# EAGLE design plugV17-Add-Large-Cap-to-support-RELAY-smd-big-size-small-pinout (EAGLE 7.6.0)
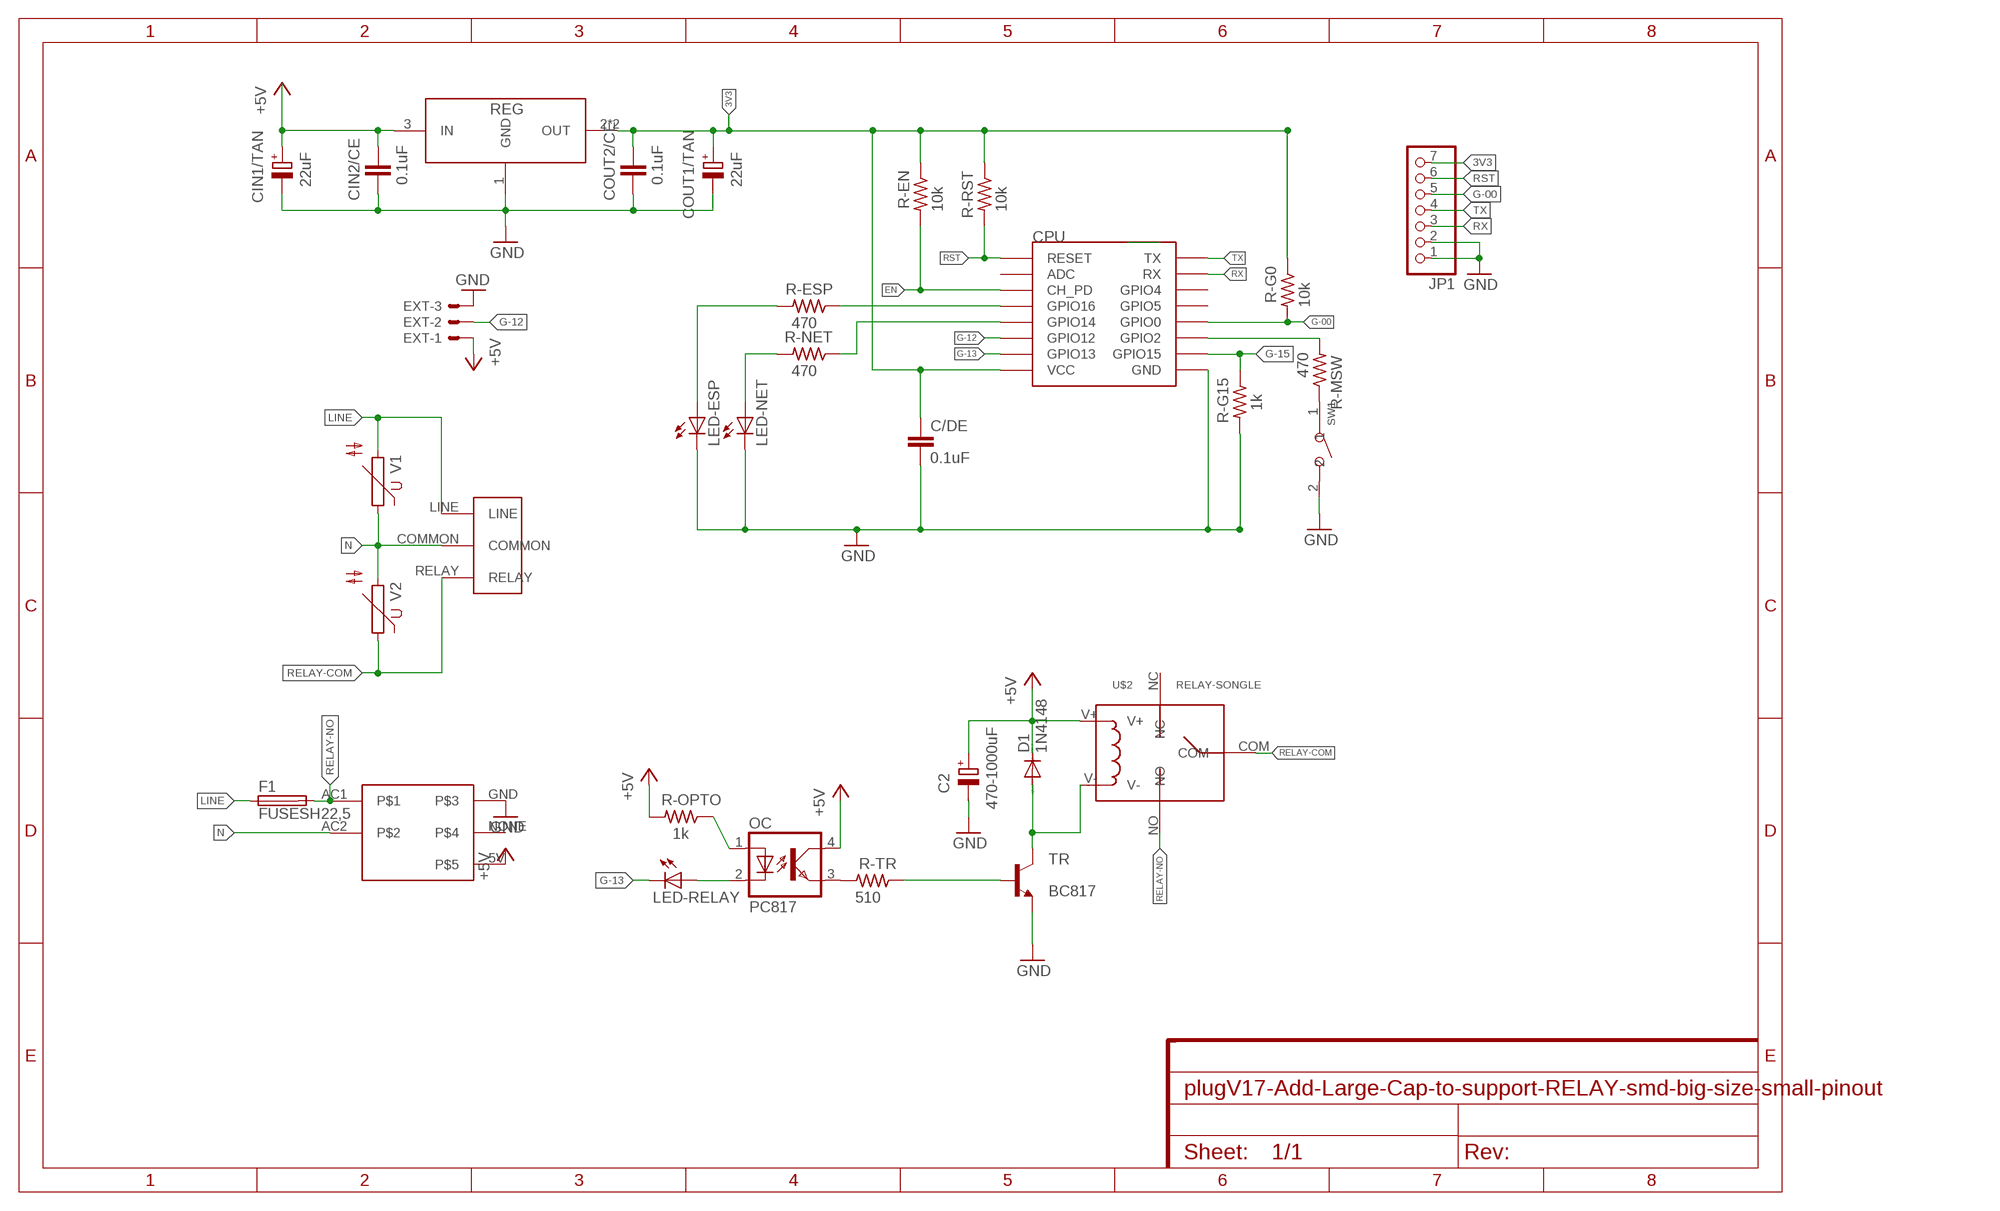
[diagram p0: schematic, sheet 1]

## Parts
C2  470-1000uF  CPOL-EUE3.5-8  [E3,5-8]
C/DE  0.1uF  C-EUC0805  [C0805]
CIN1/TAN  22uF  CPOL-EUB/3528-21R  [B/3528-21R]
CIN2/CE  0.1uF  C-EUC0805K  [C0805K]
COUT1/TAN  22uF  CPOL-EUB/3528-21R  [B/3528-21R]
COUT2/CE  0.1uF  C-EUC0805K  [C0805K]
CPU  ESP12SMD  [ESP12-SMD]
D1  1N4148  1N4148DO35-7  [DO35-7]
EXT  53048-03  [53048-03]
F1  FUSESH22,5  [SH22,5]
JP1  PINHD-1X7  [1X07]
LED-ESP  LEDCHIPLED_0805  [CHIPLED_0805]
LED-NET  LEDCHIPLED_0805  [CHIPLED_0805]
LED-RELAY  LEDCHIPLED_0805  [CHIPLED_0805]
OC  PC817  [DIL04]
R-EN  10k  R-US_M0805  [M0805]
R-ESP  470  R-US_M0805  [M0805]
R-G0  10k  R-US_M0805  [M0805]
R-G15  1k  R-US_M0805  [M0805]
R-MSW  470  R-US_M0805  [M0805]
R-NET  470  R-US_M0805  [M0805]
R-OPTO  1k  R-US_M0805  [M0805]
R-RST  10k  R-US_M0805  [M0805]
R-TR  510  R-US_M0805  [M0805]
REG  AMS1117-3.3  [SOT-223]
SW1  DIP-BUTTON(2P-6.0X3.0X4.3MM)-TS-1101F  [SW2-5.0-6.0X3.0X4.3MM]
TR  BC817  BC817-16SMD  [SOT23-BEC]
U$1  POWER-RELAY-FOOTPRINT  [POWER-RELAY-FOOTPRINT]
U$2  RELAY-SONGLE  [RELAY-SONGLE]
U$4  POWERSUPPLY-5V-700MA  [POWERSUPPLY-5V-700MA]
V1  S14K11  [S14K11]
V2  S14K11  [S14K11]

## Nets
3V3: C/DE.1 COUT1/TAN.+ COUT2/CE.1 CPU.VCC JP1.7 R-EN.1 R-G0.1 R-RST.1 REG.2(OUT) REG.4(OUT)
+5V: C2.+ CIN1/TAN.+ CIN2/CE.1 D1.C EXT.1 OC.4(COL) R-OPTO.2 REG.3(IN) U$2.V+ U$4.5V
EN: CPU.CH_PD R-EN.2
G-00: CPU.GPIO0 JP1.5 R-G0.2
G-12: CPU.GPIO12 EXT.2
G-13: CPU.GPIO13 LED-RELAY.C
G-15: CPU.GPIO15 R-G15.1
GND: C2.- C/DE.2 CIN1/TAN.- CIN2/CE.2 COUT1/TAN.- COUT2/CE.2 CPU.GND EXT.3 JP1.1 JP1.2 LED-ESP.C LED-NET.C R-G15.2 REG.1(GND) SW1.2 TR.E U$4.GND
LINE: F1.1 U$1.LINE V1.2
N: U$1.COMMON U$4.AC2 V1.1 V2.2
N$1: OC.3(EMIT) R-TR.2
N$2: R-TR.1 TR.B
N$3: R-MSW.1 SW1.1
N$6: LED-ESP.A R-ESP.2
N$7: CPU.GPIO2 R-MSW.2
N$8: CPU.GPIO14 R-NET.1
N$13: OC.1(A) R-OPTO.1
N$16: LED-NET.A R-NET.2
N$17: D1.A TR.C U$2.V-
N$19: CPU.GPIO16 R-ESP.1
N$21: LED-RELAY.A OC.2(C)
RELAY-COM: U$1.RELAY U$2.COM V2.1
RELAY-NO: F1.2 U$2.NO U$4.AC1
RST: CPU.RESET JP1.6 R-RST.2
RX: CPU.RXD0(RX) JP1.3
TX: CPU.TXD0(TX) JP1.4
Unconnected: CPU.ADC CPU.GPIO4 CPU.GPIO5 U$2.NC U$4.NONE

## Library data of the parts
C2 CIN1/TAN COUT1/TAN = rcl:CPOL-EU: POLARIZED CAPACITOR, European symbol
C/DE CIN2/CE COUT2/CE = rcl:C-EU: CAPACITOR, European symbol
CPU = esp8266modules:ESP12: ESP8266 Wifi module 12
D1 = diode:1N4148: DIODE high speed (Philips)
EXT = con-molex:53?-03: CONNECTOR wire to board 1.25 mm (.049 inch) pitch header; MF: WALDOM/MOLEX; MPN: 53048-0310; OC_FARNELL: 9732918; OC_NEWARK: 38C9908
F1 = fuse:FUSE: Fuse; OC_FARNELL: unknown; OC_NEWARK: unknown
JP1 = pinhead:PINHD-1X7: PIN HEADER
LED-ESP LED-NET LED-RELAY = led:LED: LED OSRAM: - CHIPLED LG R971, LG N971, LY N971, LG Q971, LY Q971, LO R971, LY R971 LH N974, LH R974 LS Q976, LO Q976, LY Q976 LO Q996 - Hyper CHIPLED LW Q18S LB Q993, LB Q99A, LB R99A - SideLED LS A670, LO A670, LY A670, LG A670, LP A670 LB A673, LV A673, LT A673, LW A673 LH A674 LY A675 LS A676, LA A676, LO A676, LY A676, LW A676 LS A679, LY A679, LG A679 - Hyper Micro SIDELED® LS Y876, LA Y876, LO Y876, LY Y876 LT Y87S - SmartLED LW L88C, LW L88S LB L89C, LB L89S, LG L890 LS L89K, LO L89K, LY L89K LS L896, LA L896, LO L896, LY L896 - TOPLED LS T670, LO T670, LY T670, LG T670, LP T670 LSG T670, LSP T670, LSY T670, LOP T670, LYG T670 LG T671, LOG T671, LSG T671 LB T673, LV T673, LT T673, LW T673 LH T674 LS T676, LA T676, LO T676, LY T676, LB T676, LH T676, LSB T676, LW T676 LB T67C, LV T67C, LT T67C, LS T67K, LO T67K, LY T67K, LW E67C LS E67B, LA E67B, LO E67B, LY E67B, LB E67C, LV E67C, LT E67C LW T67C LS T679, LY T679, LG T679 LS T770, LO T770, LY T770, LG T770, LP T770 LB T773, LV T773, LT T773, LW T773 LH T774 LS E675, LA E675, LY E675, LS T675 LS T776, LA T776, LO T776, LY T776, LB T776 LHGB T686 LT T68C, LB T68C - Hyper Mini TOPLED® LB M676 - Mini TOPLED Santana® LG M470 LS M47K, LO M47K, LY M47K Source: http://www.osram.convergy.de LUXEON: - LUMILED® LXK2-PW12-R00, LXK2-PW12-S00, LXK2-PW14-U00, LXK2-PW14-V00 LXK2-PM12-R00, LXK2-PM12-S00, LXK2-PM14-U00 LXK2-PE12-Q00, LXK2-PE12-R00, LXK2-PE12-S00, LXK2-PE14-T00, LXK2-PE14-U00 LXK2-PB12-K00, LXK2-PB12-L00, LXK2-PB12-M00, LXK2-PB14-N00, LXK2-PB14-P00, LXK2-PB14-Q00 LXK2-PR12-L00, LXK2-PR12-M00, LXK2-PR14-Q00, LXK2-PR14-R00 LXK2-PD12-Q00, LXK2-PD12-R00, LXK2-PD12-S00 LXK2-PH12-R00, LXK2-PH12-S00 LXK2-PL12-P00, LXK2-PL12-Q00, LXK2-PL12-R00 Source: www.luxeon.com KINGBRIGHT: KA-3528ASYC Source: www.kingbright.com
OC = optocoupler:PC817: SHARP OPTO COUPLER; MPN: PC817X4J000F; OC_FARNELL: 9707727; OC_NEWARK: 97K7059
R-EN R-ESP R-G0 R-G15 R-MSW R-NET R-OPTO R-RST R-TR = rcl:R-US_: RESISTOR, American symbol
REG = AMS1117-3.3:AMS1117-3.3: 1A LOW DROPOUT VOLTAGE REGULATOR
SW1 = Seeed-OPL-Switch:DIP-BUTTON(2P-6.0X3.0X4.3MM): 311020025
TR = transistor-npn:BC817*: NPN Transistor
U$1 = Power-Plug-Footprint:POWER-RELAY-FOOTPRINT
U$2 = Relay-Songle:RELAY-SONGLE
U$4 = PowerSupply-5V-700mA:POWERSUPPLY-5V-700MA
V1 V2 = varistor:S14K11: VARISTOR

## Board
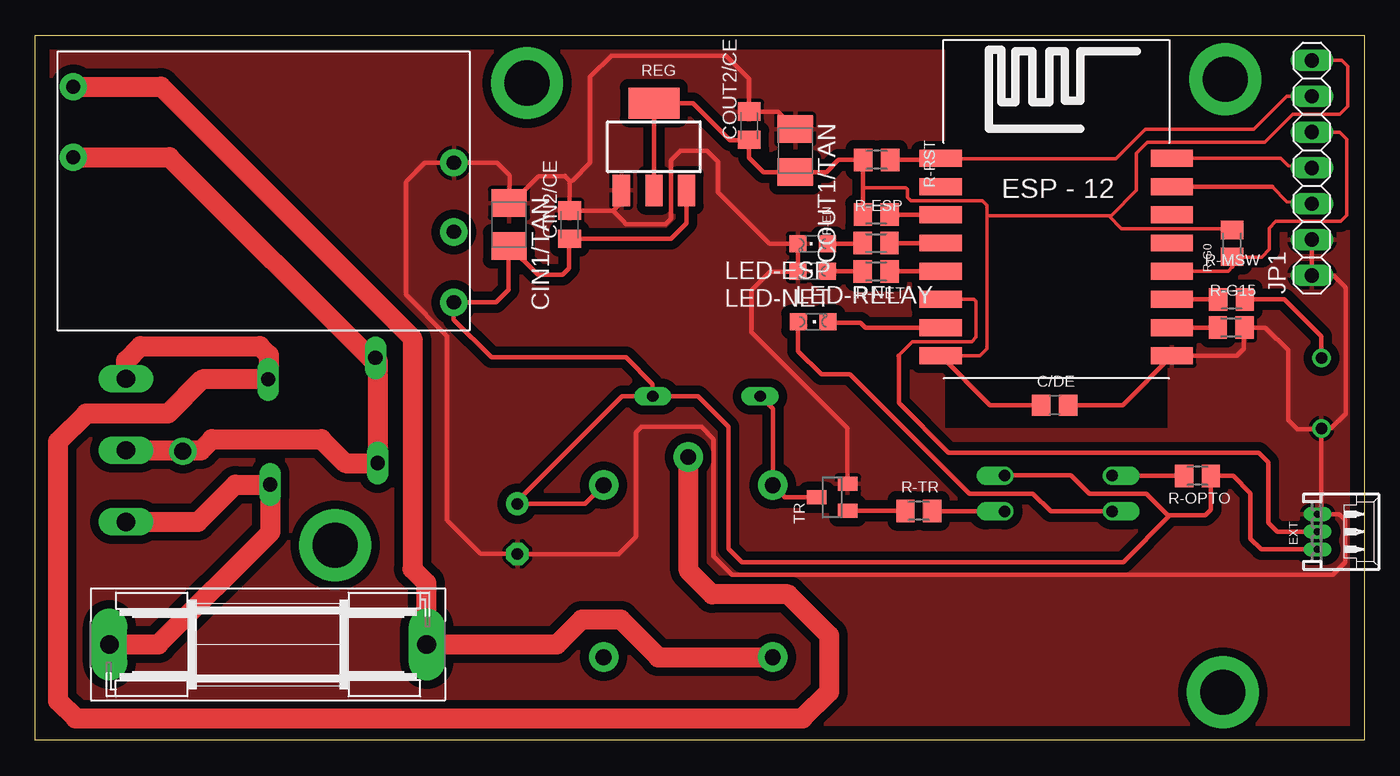
[diagram p1: board, top side]
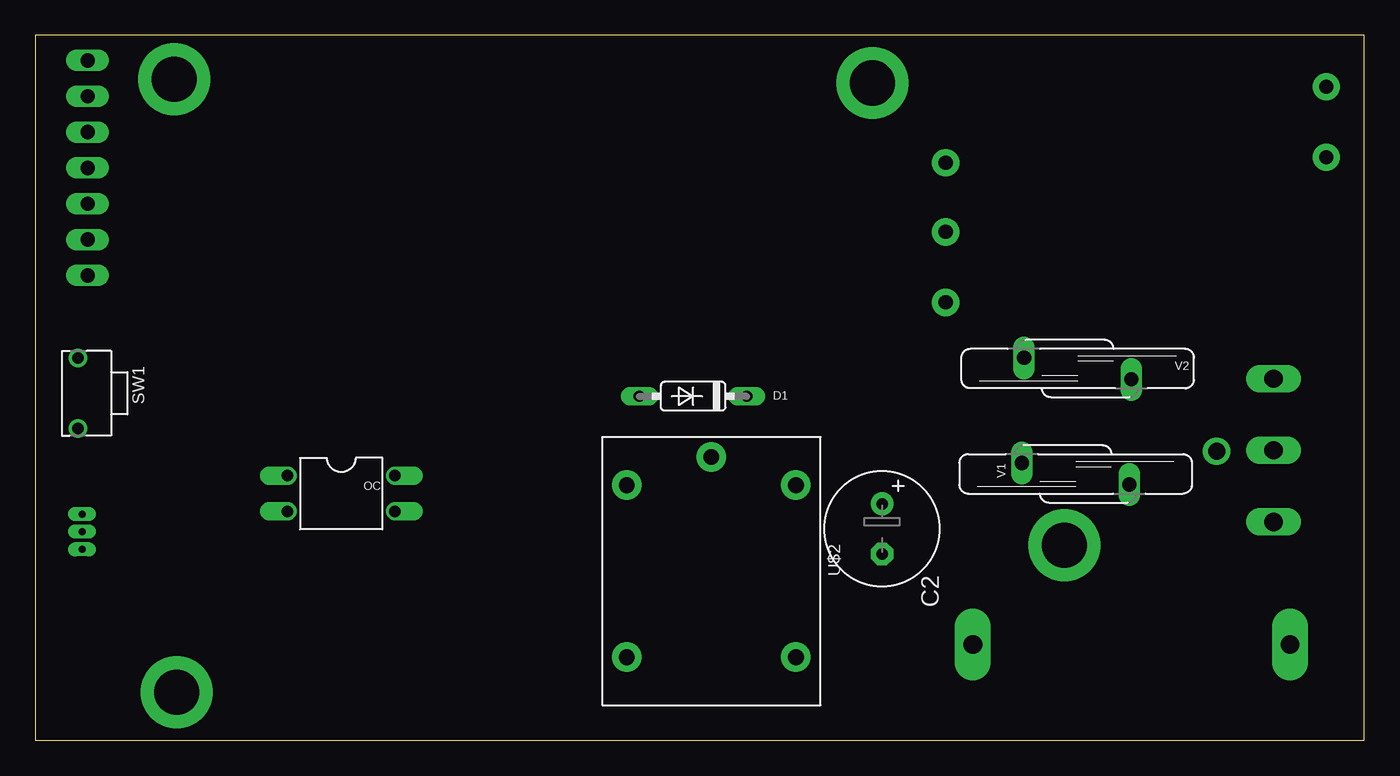
[diagram p2: board, bottom side, seen from below]

Size 94.3 x 50.01 mm. Coordinates in mm from the lower left corner, seen from the top.
Outline: 0,0.01 0,50.01 94.29,50.01 94.3,0 0,0.01
Copper layers (1*16): Top 0.035mm / dielectric 1.5mm / Bottom 0.035mm
Design rules "default": minimum track width 10mil, minimum drill 24mil, track to track 8mil, track to pad 8mil, pad to pad 8mil, via to via 8mil, smd to smd 8mil, copper to edge 40mil, drill to drill 8mil, minimum pad ring 10mil, minimum via ring 8mil, stop-mask expansion 4mil, vias tented up to drill 0mil, thermal gap 10mil

### Footprints (pad centres in the part's own frame; a part is rotated, then mirrored left to right if it is on the bottom)
E3,5-8 = drill 0.813 pad 1.6: + -1.778,0 | drill 0.813 pad 1.6 octagon: - 1.778,0
C0805 = smd 1.3 x 1.5: 1 -0.95,0; 2 0.95,0
B/3528-21R = smd 1.95 x 2.5: + 1.525,0; - -1.525,0
C0805K = smd 1.3 x 1.6: 1 -1,0; 2 1,0
ESP12-SMD = smd 3 x 1.2: ADC -8.3,3.8; CH_PD -8.3,1.8; GND 8.1,-8.2; GPIO0 8.1,-2.2; GPIO2 8.1,-4.2; GPIO4 8.1,1.8; GPIO5 8.1,-0.2; GPIO12 -8.3,-4.2; GPIO13 -8.3,-6.2; GPIO14 -8.3,-2.2; GPIO15 8.1,-6.2; GPIO16 -8.3,-0.2; RESET -8.3,5.8; RXD0 8.1,3.8; TXD0 8.1,5.8; VCC -8.3,-8.2
DO35-7 = drill 0.813 long: A 3.81,0; C -3.81,0
53048-03 = drill 0.5 pad 0.698 long: 1 1.25,-1.25; 2 0,-1.25; 3 -1.25,-1.25
SH22,5 = drill 1.321 pad 2.54 long: 1 -11.252,0; 2 11.252,0
1X07 = drill 1.016 long: 1 -7.62,0; 2 -5.08,0; 3 -2.54,0; 4 0,0; 5 2.54,0; 6 5.08,0; 7 7.62,0
CHIPLED_0805 = smd 1.2 x 1.2: A 0,-1.05; C 0,1.05
DIL04 = drill 0.813 offset: 1 -1.27,-3.81; 2 1.27,-3.81; 3 1.27,3.81; 4 -1.27,3.81
M0805 = smd 1.3 x 1.6: 1 -0.95,0; 2 0.95,0
SOT-223 = smd 1.219 x 2.235: 1 -2.381,-3.099; 2 -0.07,-3.099; 3 2.241,-3.099 | smd 3.6 x 2.2: 4 -0.07,3.099
SW2-5.0-6.0X3.0X4.3MM = drill 0.8 pad 1.27: 1 -2.5,0; 2 2.5,0
SOT23-BEC = smd 1 x 1.4: B -0.95,-1.1; C 0,1.1; E 0.95,-1.1
POWER-RELAY-FOOTPRINT = drill 1.3 long: COMMON 0,0; LINE -5.08,0; RELAY 5.08,0
RELAY-SONGLE = drill 1.118 pad 2.1: COM -8.1,0; NC 6.1,6; NO 6.1,-6; V+ -6.1,6; V- -6.1,-6
POWERSUPPLY-5V-700MA = drill 1 pad 1.93: 5V 13.5,-7.9; AC1 -13.5,7.4; AC2 -13.5,2.4; GND 13.5,2; NONE 13.5,-2.9
S14K11 = drill 1.016 long: 1 -0.762,-3.81; 2 0.762,3.81

### Placement (x,y rotation side)
C2  34.22,15 270 bottom
C/DE  72.33,23.77 0 top
CIN1/TAN  33.62,36.58 270 top
CIN2/CE  37.91,36.58 90 top
COUT1/TAN  53.93,41.83 270 top
COUT2/CE  50.66,43.6 90 top
CPU  72.55,35.47 0 top
D1  47.62,24.4 180 bottom
EXT  92.23,14.79 270 top
F1  16.52,6.8 0 top
JP1  90.58,40.6 90 top
LED-ESP  55.16,35.23 90 top
LED-NET  55.16,33.27 90 top
LED-RELAY  55.2,29.68 270 top
OC  72.58,17.5 270 bottom
R-EN  59.68,37.28 0 top
R-ESP  59.66,35.27 180 top
R-G0  84.92,35.25 270 top
R-G15  84.86,29.28 0 top
R-MSW  84.87,31.27 180 top
R-NET  59.67,33.27 180 top
R-OPTO  82.46,18.76 0 top
R-RST  59.71,41.17 0 top
R-TR  62.69,16.28 0 top
REG  43.97,42.1 0 top
SW1  91.26,24.62 270 bottom
TR  56.54,17.24 90 top
U$1  6.44,20.57 90 bottom
U$2  46.33,12 270 bottom
U$4  16.2,38.96 0 top
V1  20.48,18.9 270 bottom
V2  20.34,26.37 90 bottom

### Tracks (layer width: path | path; a pad name or v marks a point on that pad's centre or on a via)
3V3
  Top 0.254: CPU.VCC 67.02,27.27 67.53,27.78 67.53,37.19 | 58.73,39.18 61.79,39.18 61.9,39.07 61.9,38.53 62.15,38.28 67.19,38.28 67.53,37.94 67.53,37.19 | 84.85,36.27 77.08,36.27 76.16,37.19 | JP1.7 92.7,48.22 93.12,47.8 93.12,44.97 92.57,44.42 89.23,44.42 87.24,42.43 78.92,42.43 78.14,41.65 78.14,39.01 76.31,37.18 76.3,37.19 76.16,37.19 | 76.16,37.19 67.53,37.19
  Top 0.305: COUT1/TAN.+ 56.12,40.3 56.99,41.17 R-RST.1 58.73,41.14 58.73,39.18 R-EN.1 | CPU.VCC 67.75,23.78 C/DE.1 | R-G0.1 84.85,36.27 | 53.84,40.22 COUT1/TAN.+ | COUT1/TAN.+ 53.91,40.29 51.68,40.29 50.66,41.31 COUT2/CE.1 50.64,42.58 49.28,42.58 46.66,45.2 REG.4 REG.2
+5V
  Top 0.305: 80.51,15.96 80.36,15.96 78.84,17.48 74.79,17.48 73.48,18.79 68.79,18.79 OC.4 | 80.51,15.96 83.03,15.96 83.41,16.34 R-OPTO.2 85,18.75 86.23,17.52 86.23,14.31 87,13.54 EXT.1 | 80.51,15.96 77.19,12.64 50.13,12.64 49.18,13.59 49.18,22.24 47.02,24.4 D1.C | D1.C 41.62,24.4 34.22,17 C2.+ 39.01,16.78 U$2.V+ | D1.C 43.81,25.26 41.91,27.16 32.37,27.16 29.7,29.83 U$4.5V 32.71,31.06 33.6,31.95 33.6,35.03 CIN1/TAN.+ 33.63,35.05 35.66,33.03 37.43,33.03 37.88,33.48 37.88,35.55 CIN2/CE.1 45.12,35.58 46.2,36.66 REG.3
EN
  Top 0.305: R-EN.2 64.24,37.28 CPU.CH_PD
G-00
  Top 0.254: CPU.GPIO0 84.64,33.27 84.95,33.58 | 84.94,34.28 87.04,34.28 87.58,34.82 87.58,36.34 88.04,36.8 92.63,36.8 93.07,37.24 93.07,42.63 92.56,43.14 JP1.5
  Top 0.305: 84.95,33.58 84.95,34.27 R-G0.2 84.94,34.28
G-12
  Top 0.254: 64.28,31.3 66.6,31.3 66.76,31.14 66.76,28.59 66.45,28.28 62.25,28.28 61.26,27.29
  Top 0.305: CPU.GPIO12 64.28,31.3 | 61.26,27.29 61.27,27.28 61.27,23.95 64.81,20.41 86.8,20.41 87.49,19.72 87.49,15.42 88.12,14.79 EXT.2
G-13
  Top 0.305: CPU.GPIO13 58.9,29.27 58.56,29.61 56.32,29.61 LED-RELAY.C
G-15
  Top 0.305: CPU.GPIO15 R-G15.1
GND
  Top 0.305: 37.6,40.01 35.7,40.01 33.8,38.1 CIN1/TAN.- 33.67,38.16 33.67,40.07 32.78,40.96 U$4.GND 27.63,40.96 26.3,39.63 26.3,31.59 29.22,28.67 29.22,15.6 31.6,13.22 C2.- 34.24,13.2 41.39,13.2 42.64,14.45 42.64,21.85 43.02,22.23 47.28,22.23 48.14,21.37 48.14,13.04 49.44,11.74 92.05,11.74 92.95,12.64 92.95,15.62 92.54,16.03 90.99,16.03 EXT.3 91.26,16.04 SW1.2 | 37.6,40.01 37.92,39.69 | 37.92,39.69 CIN2/CE.2 40.99,37.57 | REG.1 41.66,38.24 40.99,37.57 | C/DE.2 77.15,23.78 CPU.GND 85.27,27.27 85.77,27.77 85.77,29.24 R-G15.2 87.28,29.28 88.9,27.66 88.9,22.71 89.53,22.08 91.26,22.08 SW1.2 | JP1.2 JP1.1 92.11,32.98 92.99,32.1 92.99,23.18 91.93,22.12 SW1.2 | COUT1/TAN.- 52.69,44.6 COUT2/CE.2 50.66,46.91 49,48.57 40.89,48.57 39.38,47.06 39.38,40.96 38.11,39.69 37.92,39.69 | 40.99,37.57 41.7,36.86 41.7,36.85 41.93,36.62 44.73,36.62 45.11,37 45.11,41.15 45.79,41.83 47.66,41.83 48.44,41.05 48.44,38.89 52.1,35.23 LED-ESP.C LED-NET.C 54.07,33.23 52.15,33.23 50.83,31.91 50.83,28.93 57.64,22.12 TR.E | 37.58,40.03 37.6,40.01
  pour Top (isolate 0.61): 0,0.01 94.3,0.01 94.3,50.01 80.51,50.01 80.51,22.01 64.4,22.01 64.4,50.01 0,50.01
LINE
  Top 1.422: U$1.LINE 11.55,15.49 14.19,18.13 V1.2 16.69,18.12 16.69,14.76 8.73,6.8 F1.1
N
  Top 1.422: V2.2 24.29,26.99 24.29,26.59 | 24.29,26.59 V1.1 22,19.66 20.3,21.36 12.55,21.36 11.76,20.57 U$1.COMMON | U$4.AC2 9.52,41.36 24.29,26.59
N$1
  Top 0.305: R-TR.2 63.69,16.23 OC.3
N$2
  Top 0.305: TR.B R-TR.1
N$3
  Top 0.305: R-MSW.1 88.64,31.27 91.25,28.66 SW1.1
N$6
  Top 0.305: LED-ESP.A 58.67,35.23 R-ESP.2
N$7
  Top 0.305: CPU.GPIO2 R-MSW.2
N$8
  Top 0.305: R-NET.1 CPU.GPIO14
N$9  (via drill 3.2 pad 5.1)
  other vias: 21.29,13.83
N$13
  Top 0.305: R-OPTO.1 76.41,18.76 OC.1
N$16
  Top 0.305: LED-NET.A R-NET.2
N$17
  Top 0.305: TR.C 53.17,17.24 53.17,17.27 52.37,18.07 52.36,18.07 U$2.V- 52.33,23.5 D1.A
N$18  (via drill 3.2 pad 5.1)
  other vias: 34.9,46.62
N$19
  Top 0.305: R-ESP.1 CPU.GPIO16
N$20  (via drill 1.2 pad 1.93)
  other vias: 10.48,20.51
N$21
  Top 0.305: OC.2 72.05,16.23 70.79,17.49 66.28,17.49 57.81,25.96 55.77,25.96 54.13,27.6 54.13,29.66 LED-RELAY.A
N$22  (via drill 3.2 pad 5.1)
  other vias: 84.27,3.42
N$23  (via drill 3.2 pad 5.1)
  other vias: 84.43,46.88
RELAY-COM
  Top 0.305: 46.36,20.07 U$2.COM
  Top 1.422: U$1.RELAY 6.44,26.94 7.46,27.96 15.94,27.96 16.57,27.33 16.57,25.65 V2.1 11.85,25.61 9.42,23.18 3.6,23.18 1.61,21.19 1.61,2.8 2.86,1.55 54.45,1.55 56.34,3.44 56.34,7.43 53.41,10.36 48.03,10.36 46.36,12.03 46.36,20.07
RELAY-NO
  Top 1.422: U$4.AC1 8.92,46.36 26.77,28.51 26.77,12.14 27.74,11.17 27.74,6.83 F1.2 37.02,6.8 38.79,8.57 41.53,8.57 44.21,5.89 U$2.NO
RST
  Top 0.254: 64.28,41.25 76.69,41.25 78.78,43.34 86.45,43.34 88.8,45.69 JP1.6
  Top 0.305: R-RST.2 64.15,41.17 CPU.RESET 64.28,41.25 | JP1.6
RX
  Top 0.254: 87.76,39.27 88.82,38.21 JP1.3
  Top 0.305: CPU.RXD0 87.76,39.27
TX
  Top 0.254: CPU.TXD0 88.38,41.27 88.9,40.75 JP1.4